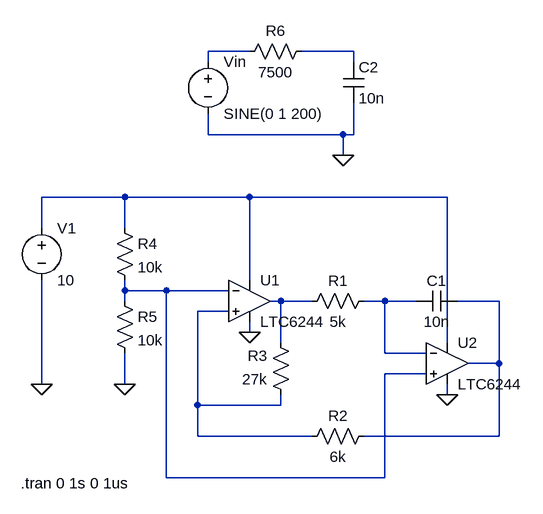
[diagram p0: schematic Triangle Wave Gen 10V.asc]
Triangle Wave Gen 10V.asc, the LTspice schematic file:
Version 4
SHEET 1 1480 680
WIRE 112 -240 48 -240
WIRE 272 -240 192 -240
WIRE 48 -224 48 -240
WIRE 272 -224 272 -240
WIRE 48 -112 48 -144
WIRE 256 -112 48 -112
WIRE 272 -112 272 -160
WIRE 272 -112 256 -112
WIRE 256 -80 256 -112
WIRE -80 -16 -208 -16
WIRE 112 -16 -80 -16
WIRE 416 -16 112 -16
WIRE -208 32 -208 -16
WIRE -80 32 -80 -16
WIRE 112 112 112 -16
WIRE -80 128 -80 112
WIRE -16 128 -80 128
WIRE 80 128 -16 128
WIRE -80 144 -80 128
WIRE 160 144 144 144
WIRE 208 144 160 144
WIRE 320 144 288 144
WIRE 368 144 320 144
WIRE 496 144 432 144
WIRE 80 160 32 160
WIRE 112 192 112 176
WIRE 160 208 160 144
WIRE 416 208 416 -16
WIRE 320 224 320 144
WIRE 384 224 320 224
WIRE 496 240 496 144
WIRE 496 240 448 240
WIRE 384 256 320 256
WIRE -208 272 -208 112
WIRE -80 272 -80 224
WIRE 416 288 416 272
WIRE 32 304 32 160
WIRE 160 304 160 288
WIRE 160 304 32 304
WIRE 32 352 32 304
WIRE 208 352 32 352
WIRE 496 352 496 240
WIRE 496 352 288 352
WIRE -16 416 -16 128
WIRE 320 416 320 256
WIRE 320 416 -16 416
FLAG -80 272 0
FLAG 112 192 0
FLAG 416 288 0
FLAG -208 272 0
FLAG 256 -80 0
SYMBOL res 304 128 R90
WINDOW 0 0 56 VBottom 2
WINDOW 3 32 56 VTop 2
SYMATTR InstName R1
SYMATTR Value 5k
SYMBOL res 176 304 R180
WINDOW 0 36 76 Left 2
WINDOW 3 36 40 Left 2
SYMATTR InstName R3
SYMATTR Value 27k
SYMBOL res 304 336 R90
WINDOW 0 0 56 VBottom 2
WINDOW 3 32 56 VTop 2
SYMATTR InstName R2
SYMATTR Value 6k
SYMBOL cap 432 128 R90
WINDOW 0 0 32 VBottom 2
WINDOW 3 32 32 VTop 2
SYMATTR InstName C1
SYMATTR Value 10n
SYMBOL res -96 16 R0
SYMATTR InstName R4
SYMATTR Value 10k
SYMBOL res -96 128 R0
SYMATTR InstName R5
SYMATTR Value 10k
SYMBOL voltage -208 16 R0
SYMATTR InstName V1
SYMATTR Value 10
SYMBOL OpAmps\\LTC6244 112 144 R0
SYMATTR InstName U1
SYMBOL OpAmps\\LTC6244 416 240 R0
SYMATTR InstName U2
SYMBOL cap 256 -224 R0
SYMATTR InstName C2
SYMATTR Value 10n
SYMBOL res 208 -256 R90
WINDOW 0 0 56 VBottom 2
WINDOW 3 32 56 VTop 2
SYMATTR InstName R6
SYMATTR Value 7500
SYMBOL voltage 48 -240 R0
WINDOW 123 0 0 Left 0
WINDOW 39 0 0 Left 0
SYMATTR InstName Vin
SYMATTR Value SINE(0 1 200)
TEXT -240 424 Left 2 !.tran 0 1s 0 1us

The netlist it stands for:
* Triangle Wave Gen 10V.asc
R1 N006 N005 5k
R3 N008 N005 27k
R2 N007 N008 6k
C1 N007 N006 10n
R4 N003 N004 10k
R5 N004 0 10k
V1 N003 0 10
XU1 N008 N004 N003 0 N005 LTC6244  ; pins In+ In- V+ V- OUT
XU2 N004 N006 N003 0 N007 LTC6244  ; pins In+ In- V+ V- OUT
C2 N002 0 10n
R6 N002 N001 7500
Vin N001 0 SINE(0 1 200)
.tran 0 1s 0 1us
.backanno
.end